# Altium schematic sheet tps563209_12v_to_5v.schdoc
size 292 x 119 mm; SheetNumber: 1; SheetTotal: 1
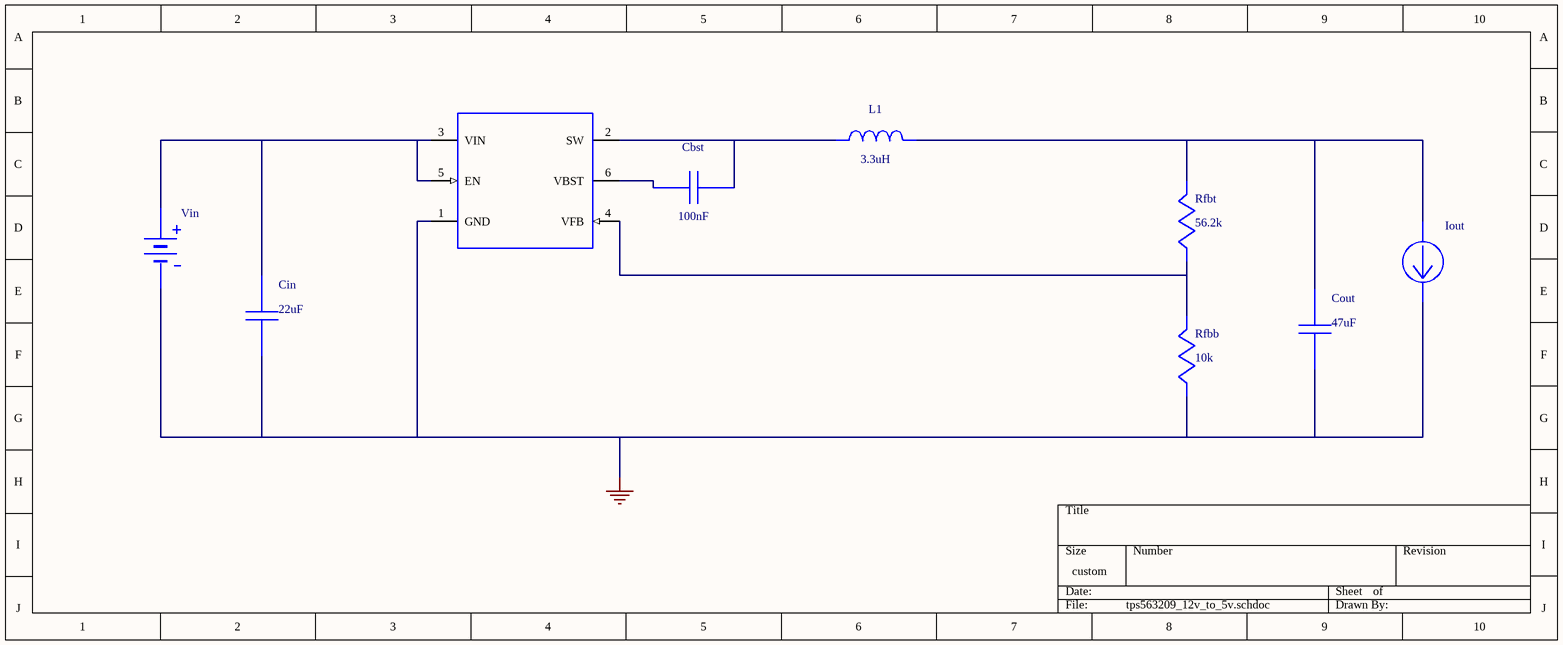
[diagram p0: tps563209_12v_to_5v.schdoc]

## Parts
Cbst  value 100nF  (hidden comment: 08053C104KAT2A)
Cin  value 22uF  (hidden comment: GRM32ER61C226KE20L)
Cout  value 47uF  (hidden comment: GRM31CR61A476KE15L)
Iout  WB_CURRENT_LOAD  (value not drawn)
L1  value 3.3uH  (hidden comment: VLP8040T-3R3N)
Rfbb  value 10k  (hidden comment: CRCW040210K0FKED)
Rfbt  value 56.2k  (hidden comment: CRCW040256K2FKED)
U1  TPS563209DDCR  (value not drawn)
Vin  WB_BATTERY  (value not drawn)

## Nets
0: Cin.2 Cout.2 Iout.2(-) Rfbb.2 U1.1(GND) Vin.2(-)
NetCbst_1: Cbst.1 L1.1 U1.2(SW)
NetCbst_2: Cbst.2 U1.6(VBST)
NetCin_1: Cin.1 U1.3(VIN) U1.5(EN) Vin.1(+)
NetCout_1: Cout.1 Iout.1(+) L1.2 Rfbt.1
NetRfbb_1: Rfbb.1 Rfbt.2 U1.4(VFB)

## Library data of the parts
Cbst = 08053C104KAT2A: Manufacturer Name: AVX; PackageReference: 08053C104KAT2A; Manufacturer Part Number: 08053C104KAT2A
Cin = GRM32ER61C226KE20L: GRM32ER61C226KE2; Manufacturer Name: MuRata; PackageReference: GRM32ER61C226KE20L; Manufacturer Part Number: GRM32ER61C226KE20L
Cout = GRM31CR61A476KE15L: GRM31CR61A476KE1; Manufacturer Name: MuRata; PackageReference: GRM31CR61A476KE15L; Manufacturer Part Number: GRM31CR61A476KE15L
Iout = WB_CURRENT_LOAD: Value: UNLISTED; PackageReference: WB_CURRENT_LOAD; Manufacturer Part Number: WB_CURRENT_LOAD; Manufacturer Name: WB_CURRENT_LOAD
L1 = VLP8040T-3R3N: Unknown; Manufacturer Name: TDK; PackageReference: VLP8040T-3R3N; Manufacturer Part Number: VLP8040T-3R3N
Rfbb = CRCW040210K0FKED: Manufacturer Name: Vishay-Dale; PackageReference: CRCW040210K0FKED; Manufacturer Part Number: CRCW040210K0FKED
Rfbt = CRCW040256K2FKED: Manufacturer Name: Vishay-Dale; PackageReference: CRCW040256K2FKED; Manufacturer Part Number: CRCW040256K2FKED
U1 = TPS563209DDCR: Manufacturer Name: Texas Instruments; PackageReference: Type; Manufacturer Part Number: TPS563209DDCR; Value: Value
Vin = WB_BATTERY: Value: UNLISTED; PackageReference: WB_BATTERY; Manufacturer Part Number: WB_BATTERY; Manufacturer Name: WB_BATTERY